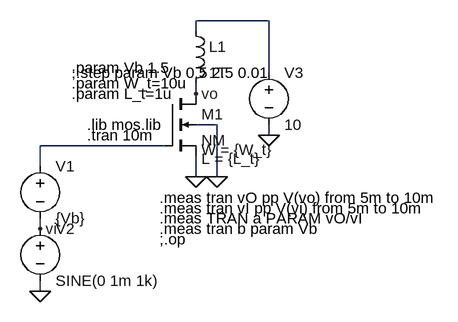
[diagram p0: schematic ngmro.asc]
ngmro.asc, the LTspice schematic file:
Version 4.1
SHEET 1 880 680
WIRE 416 -112 304 -112
WIRE 304 -96 304 -112
WIRE 416 -32 416 -112
WIRE 304 0 304 -16
WIRE 336 48 304 48
WIRE 416 64 416 48
WIRE 256 80 64 80
WIRE 64 112 64 80
WIRE 304 128 304 96
WIRE 336 128 336 48
WIRE 64 208 64 192
WIRE 64 304 64 288
FLAG 64 304 0
FLAG 416 64 0
FLAG 304 128 0
FLAG 336 128 0
FLAG 304 0 vo
FLAG 64 208 vi
SYMBOL voltage 64 96 R0
WINDOW 123 0 0 Left 0
WINDOW 39 0 0 Left 0
SYMATTR InstName V1
SYMATTR Value {Vb}
SYMBOL voltage 64 192 R0
WINDOW 123 0 0 Left 0
WINDOW 39 0 0 Left 0
SYMATTR InstName V2
SYMATTR Value SINE(0 1m 1k)
SYMBOL nmos4 256 0 R0
WINDOW 39 56 86 Left 2
WINDOW 40 56 100 Left 2
SYMATTR SpiceLine W = {W_t}
SYMATTR SpiceLine2 L = {L_t}
SYMATTR InstName M1
SYMATTR Value NM
SYMATTR Prefix X
SYMBOL voltage 416 -48 R0
WINDOW 123 0 0 Left 0
WINDOW 39 0 0 Left 0
SYMATTR InstName V3
SYMATTR Value 10
SYMBOL ind 288 -112 R0
SYMATTR InstName L1
SYMATTR Value 1T
TEXT 136 48 Left 2 !.lib mos.lib
TEXT 136 64 Left 2 !.tran 10m
TEXT 112 -16 Left 2 !.param W_t=10u
TEXT 112 0 Left 2 !.param L_t=1u
TEXT 112 -32 Left 2 !;.step param Vb 0.5 2.5 0.01
TEXT 248 160 Left 2 !.meas tran vO pp V(vo) from 5m to 10m
TEXT 248 176 Left 2 !.meas tran vI pp V(vi) from 5m to 10m
TEXT 248 192 Left 2 !.meas TRAN a PARAM vO/vI
TEXT 248 208 Left 2 !.meas tran b param Vb
TEXT 248 224 Left 2 !;.op
TEXT 112 -40 Left 2 !.param Vb 1.5

The netlist it stands for:
* ngmro.asc
V1 N002 vi {Vb}
V2 vi 0 SINE(0 1m 1k)
X§M1 vo N002 0 0 NM W = {W_t} L = {L_t}  ; pins D G S B
V3 N001 0 10
L1 N001 vo 1T
.lib mos.lib
.tran 10m
.param W_t=10u
.param L_t=1u
;.step param Vb 0.5 2.5 0.01
.meas tran vO pp V(vo) from 5m to 10m
.meas tran vI pp V(vi) from 5m to 10m
.meas TRAN a PARAM vO/vI
.meas tran b param Vb
;.op
.param Vb 1.5
.backanno
.end